# EAGLE design humidity_sensor (EAGLE 6.4)
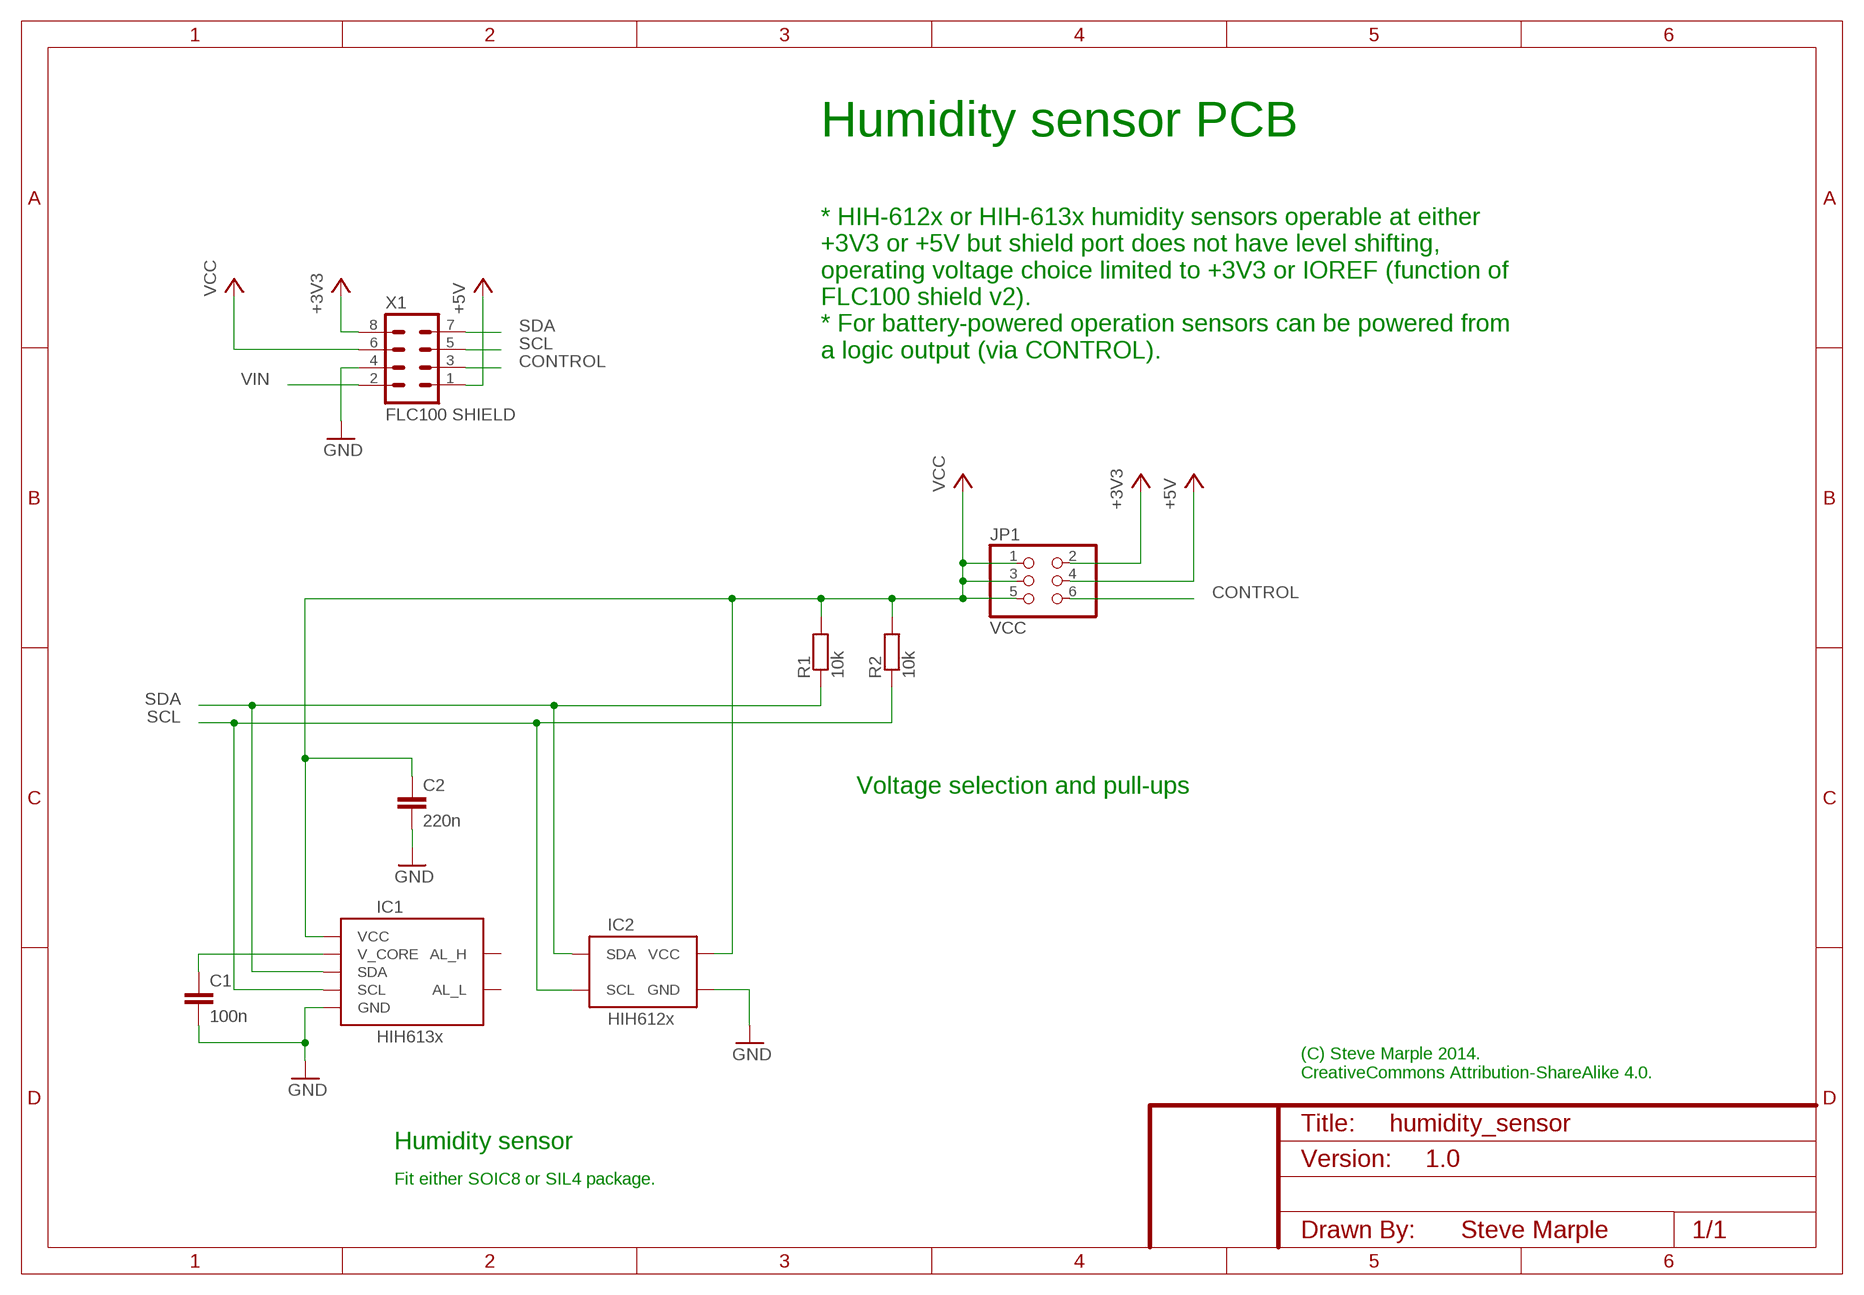
[diagram p0: schematic, sheet 1]

## Parts
C1  100n  CAPPTH  [CAP-PTH-SMALL]
C2  220n  CAPPTH  [CAP-PTH-SMALL]
IC1  HIH613x  HONEYWELL-HIH613XSOIC8  [SO08]
IC2  HIH612x  HONEYWELL-HIH612X  [SIL04]
JP1  VCC  PINHD-2X3  [2X03]
R1  10k  RESISTOR  [RES-AXIAL-0.4]
R2  10k  RESISTOR  [RES-AXIAL-0.4]
X1  FLC100 SHIELD  ML8  [ML8]

## Nets
+3V3 [power]: JP1.2 X1.8
+5V [power]: JP1.4 X1.1
CONTROL: JP1.6 X1.3
GND [power]: C1.2 C2.2 IC1.2(GND) IC2.2(GND) X1.4
N$4: C1.1 IC1.1(V_CORE)
SCL: IC1.3(SCL) IC2.3(SCL) R2.P$1 X1.5
SDA: IC1.4(SDA) IC2.4(SDA) R1.P$1 X1.7
VCC [power]: C2.1 IC1.8(VCC) IC2.1(VCC) JP1.1 JP1.3 JP1.5 R1.P$2 R2.P$2 X1.6
VIN [power]: X1.2
Unconnected: IC1.5(AL_H) IC1.6(AL_L)

## Notes on the sheet
- Humidity sensor PCB
- * HIH-612x or HIH-613x humidity sensors operable at either
  +3V3 or +5V but shield port does not have level shifting,
  operating voltage choice limited to +3V3 or IOREF (function of
  FLC100 shield v2).
  * For battery-powered operation sensors can be powered from
  a logic output (via CONTROL).
- Voltage selection and pull-ups
- (C) Steve Marple 2014.
  CreativeCommons Attribution-ShareAlike 4.0.
- Humidity sensor
- 1.0
- Fit either SOIC8 or SIL4 package.
- Steve Marple

## Library data of the parts
C1 C2 = SparkFun:CAP: Capacitor Standard 0603 ceramic capacitor, and 0.1" leaded capacitor.
IC1 = SteveMarple:HONEYWELL-HIH613X
IC2 = SteveMarple:HONEYWELL-HIH612X
JP1 = pinhead:PINHD-2X3: PIN HEADER
R1 R2 = SteveMarple:RESISTOR: 1/4W PTH resistor
X1 = SteveMarple:ML8

## Net classes
1 power: width 0.381 mm

## Board
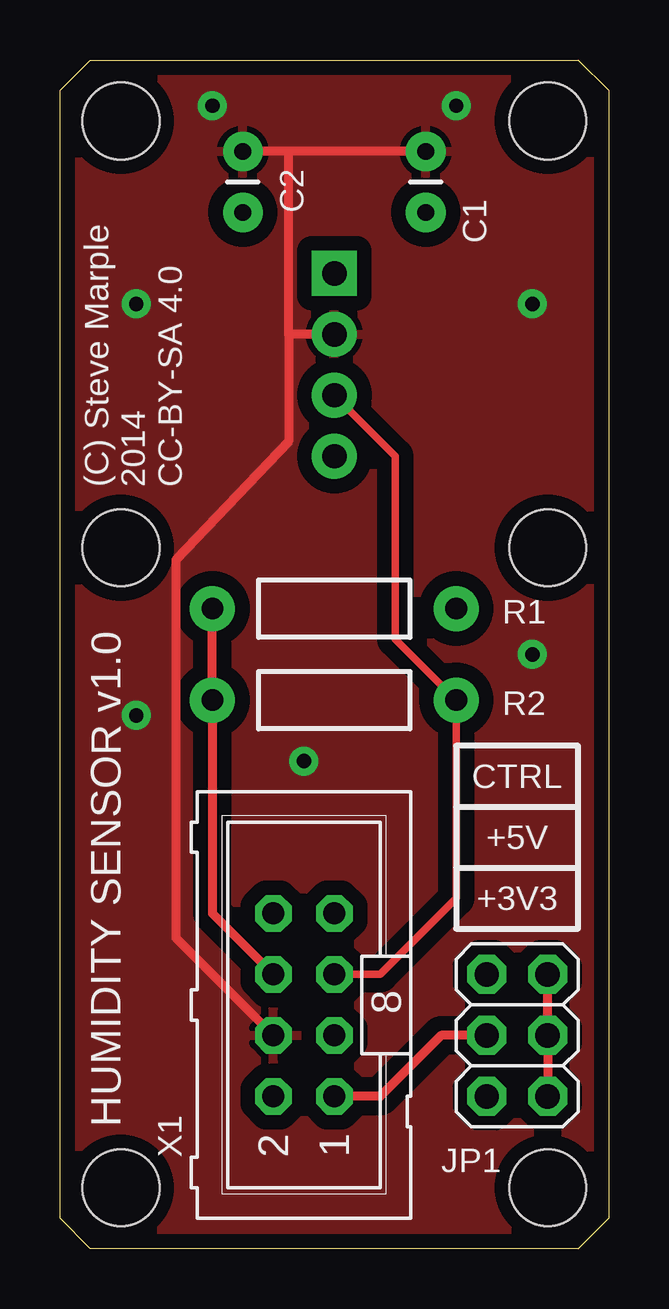
[diagram p1: board, top side]
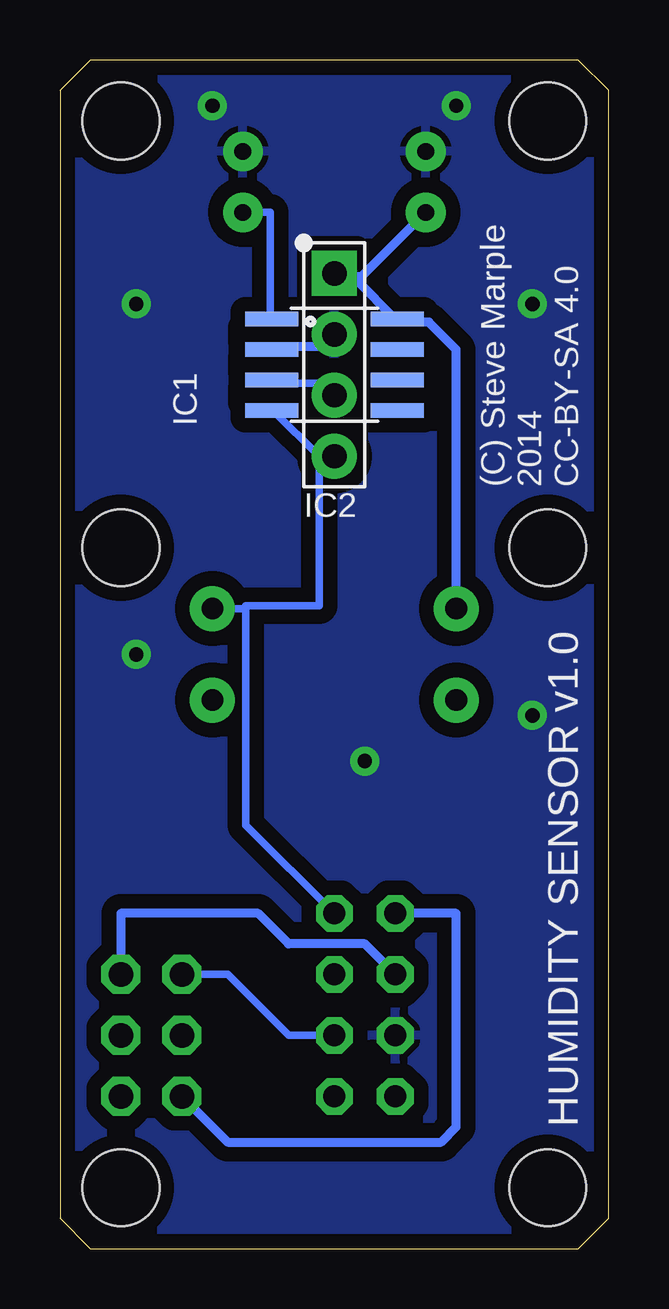
[diagram p2: board, bottom side, seen from below]

Size 22.86 x 49.53 mm. Coordinates in mm from the lower left corner, seen from the top.
Outline: 0,1.27 0,48.26 1.27,49.53 21.59,49.53 22.86,48.26 22.86,1.27 21.59,0 1.27,0 0,1.27
Copper layers (1*16): Top 0.035mm / dielectric 1.5mm / Bottom 0.035mm
Design rules "SparkFun_Iteadstudio_very_conservative": minimum track width 12mil, minimum drill 20mil, track to track 12mil, track to pad 12mil, pad to pad 12mil, via to via 12mil, smd to smd 12mil, copper to edge 0.5mm, drill to drill 8mil, minimum pad ring 12mil, minimum via ring 12mil, stop-mask expansion 4mil, vias tented up to drill 25mil, thermal gap 10mil
Holes 3.2 mm at 2.54,2.54 20.32,2.54 20.32,46.99 2.54,46.99 2.54,29.21 20.32,29.21
bRestrict: area 13,37.8 to 15.2,38.4; area 13,36.5 to 15.2,37.1; area 7.6,37.8 to 9.9,38.4; area 7.6,36.5 to 9.9,37.1; area 7.6,35.3 to 9.9,35.9; area 13,35.3 to 15.2,35.9

### Footprints (pad centres in the part's own frame; a part is rotated, then mirrored left to right if it is on the bottom)
CAP-PTH-SMALL = drill 0.7 pad 1.651: 1 0,0; 2 2.54,0
SO08 = smd 0.61 x 2.21: 1 -1.905,-2.616; 2 -0.635,-2.616; 3 0.635,-2.616; 4 1.905,-2.616; 5 1.905,2.616; 6 0.635,2.616; 7 -0.635,2.616; 8 -1.905,2.616
SIL04 = drill 1.016 pad 1.88 square: 1 -3.81,0 | drill 1.016 pad 1.88: 2 -1.27,0; 3 1.27,0; 4 3.81,0
2X03 = drill 1.016 octagon: 1 -2.54,-1.27; 2 -2.54,1.27; 3 0,-1.27; 4 0,1.27; 5 2.54,-1.27; 6 2.54,1.27
RES-AXIAL-0.4 = drill 0.9 pad 1.88: P$1 -5.08,0; P$2 5.08,0
ML8 = drill 0.914 octagon: 1 -3.81,-1.27; 2 -3.81,1.27; 3 -1.27,-1.27; 4 -1.27,1.27; 5 1.27,-1.27; 6 1.27,1.27; 7 3.81,-1.27; 8 3.81,1.27

### Placement (x,y rotation side)
C1  15.24,43.18 90 top
C2  7.62,43.18 90 top
IC1  11.43,36.83 270 bottom
IC2  11.43,36.83 270 bottom
JP1  19.05,8.89 90 top
R1  11.43,26.67 180 top
R2  11.43,22.86 180 top
X1  10.16,10.16 90 top

### Tracks (layer width: path | path; a pad name or v marks a point on that pad's centre or on a via)
+3V3
  Bottom 0.381: X1.8 6.35,13.97 6.35,5.08 6.99,4.45 15.88,4.45 JP1.2
+5V
  Top 0.381: X1.1 13.34,6.35 15.88,8.89 JP1.4
CONTROL
  Bottom 0.305: X1.3 13.34,8.89 15.88,11.43 JP1.6
GND  (via drill 0.6)
  Top 0.381: C1.2 9.53,45.72 | 9.53,45.72 C2.2 | X1.4 4.83,12.95 4.83,28.7 9.53,33.66 9.53,38.1 | IC2.2 9.53,38.1 | 9.53,38.1 9.53,45.72
  Bottom 0.381: 14.1,37.47 IC1.2 13.97,37.59 11.94,37.59 IC2.2
  other vias: 6.35,47.62 16.51,47.62 10.16,20.32 3.17,39.37 19.68,39.37 3.17,22.23 19.68,24.77
  pour Bottom (isolate 0.61): -1.27,-1.27 -1.27,50.8 24.13,50.8 24.13,-1.27
  pour Top (isolate 0.61): -2.54,52.07 25.4,52.07 25.4,-2.54 -2.54,-2.54
N$4
  Bottom 0.305: C1.1 14.1,43.18 14.1,38.73 IC1.1
SCL
  Top 0.305: X1.5 13.34,11.43 16.51,14.61 R2.P$1 13.97,25.4 13.97,33.02 IC2.3
  Bottom 0.305: IC2.3 11.94,36.07 13.84,36.07 13.97,36.2 IC1.3
SDA
  Bottom 0.305: IC1.4 13.97,34.92 12.06,33.02 IC2.4 12.06,32.89 12.06,26.8 15.11,26.8 15.11,26.67 | X1.7 15.11,17.65 15.11,26.67 | R1.P$1 15.11,26.67
VCC
  Top 0.381: JP1.1 JP1.3 JP1.5 | X1.6 6.35,13.97 R2.P$2 R1.P$2
  Bottom 0.381: 10.54,40.39 10.79,40.64 IC2.1 | 10.54,40.39 8.89,38.73 IC1.8 8.64,38.73 8.51,38.61 7.49,38.61 6.35,37.47 R1.P$2 | C2.1 10.29,40.51 10.41,40.51 10.54,40.39 | JP1.5 20.32,13.97 14.61,13.97 13.34,12.7 10.16,12.7 X1.6

### Text on the board
tSilk: CTRL | +5V | +3V3
_tsilk: (C) Steve Marple / 2014 / CC-BY-SA 4.0 | HUMIDITY SENSOR v1.0
_bsilk: (C) Steve Marple / 2014 / CC-BY-SA 4.0 | HUMIDITY SENSOR v1.0